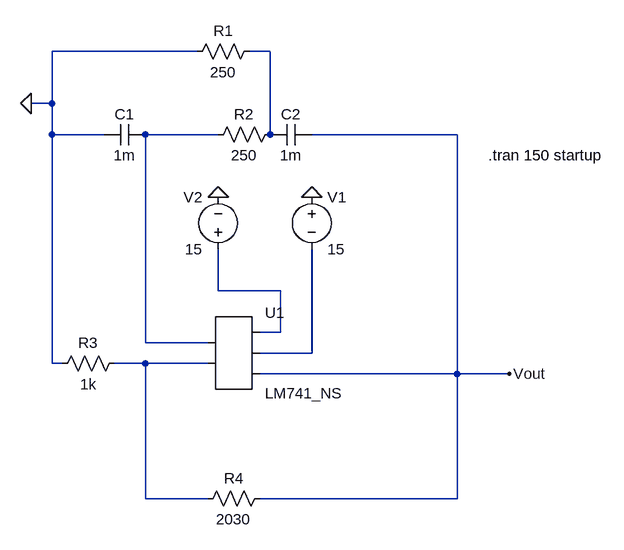
[diagram p0: schematic ee18btech11047.asc]
ee18btech11047.asc, the LTspice schematic file:
Version 4
SHEET 1 880 680
WIRE 144 -320 -80 -320
WIRE 256 -320 224 -320
WIRE -80 -240 -80 -320
WIRE -80 -240 -112 -240
WIRE -80 -192 -80 -240
WIRE 0 -192 -80 -192
WIRE 176 -192 64 -192
WIRE 256 -192 256 -320
WIRE 544 -192 320 -192
WIRE 176 48 176 -16
WIRE 272 48 176 48
WIRE 272 112 272 48
WIRE 272 112 240 112
WIRE 64 128 64 -192
WIRE 160 128 64 128
WIRE 320 144 320 -16
WIRE 320 144 240 144
WIRE -80 160 -80 -192
WIRE -64 160 -80 160
WIRE 64 160 16 160
WIRE 160 160 64 160
WIRE 544 176 544 -192
WIRE 544 176 240 176
WIRE 624 176 544 176
WIRE 64 368 64 160
WIRE 160 368 64 368
WIRE 544 368 544 176
WIRE 544 368 240 368
FLAG 176 -96 0
FLAG 320 -96 0
FLAG -112 -240 0
FLAG 624 176 Vout
SYMBOL AutoGenerated\\LM741_NS 192 144 R0
SYMATTR InstName U1
SYMBOL cap 64 -208 R90
WINDOW 0 0 32 VBottom 2
WINDOW 3 32 32 VTop 2
SYMATTR InstName C1
SYMATTR Value 1m
SYMBOL res 240 -336 R90
WINDOW 0 0 56 VBottom 2
WINDOW 3 32 56 VTop 2
SYMATTR InstName R1
SYMATTR Value 250
SYMBOL cap 320 -208 R90
WINDOW 0 0 32 VBottom 2
WINDOW 3 32 32 VTop 2
SYMATTR InstName C2
SYMATTR Value 1m
SYMBOL res 272 -208 R90
WINDOW 0 0 56 VBottom 2
WINDOW 3 32 56 VTop 2
SYMATTR InstName R2
SYMATTR Value 250
SYMBOL voltage 320 -112 R0
WINDOW 123 0 0 Left 2
WINDOW 39 0 0 Left 2
SYMATTR InstName V1
SYMATTR Value 15
SYMBOL voltage 176 0 R180
WINDOW 0 24 96 Left 2
WINDOW 3 24 16 Left 2
WINDOW 123 0 0 Left 2
WINDOW 39 0 0 Left 2
SYMATTR InstName V2
SYMATTR Value 15
SYMBOL res 32 144 R90
WINDOW 0 0 56 VBottom 2
WINDOW 3 32 56 VTop 2
SYMATTR InstName R3
SYMATTR Value 1k
SYMBOL res 256 352 R90
WINDOW 0 0 56 VBottom 2
WINDOW 3 32 56 VTop 2
SYMATTR InstName R4
SYMATTR Value 2030
TEXT 592 -160 Left 2 !.tran 150 startup

The netlist it stands for:
* ee18btech11047.asc
* U1: LM741_NS (symbol AutoGenerated\LM741_NS not available, pins judged from their places): pin1=N002 pin2=N005 pin3=N003 pin4=N004 pin5=Vout
C1 N002 0 1m
R1 N001 0 250
C2 Vout N001 1m
R2 N001 N002 250
V1 0 N004 15
V2 N003 0 15
R3 N005 0 1k
R4 Vout N005 2030
.tran 150 startup
.backanno
.end